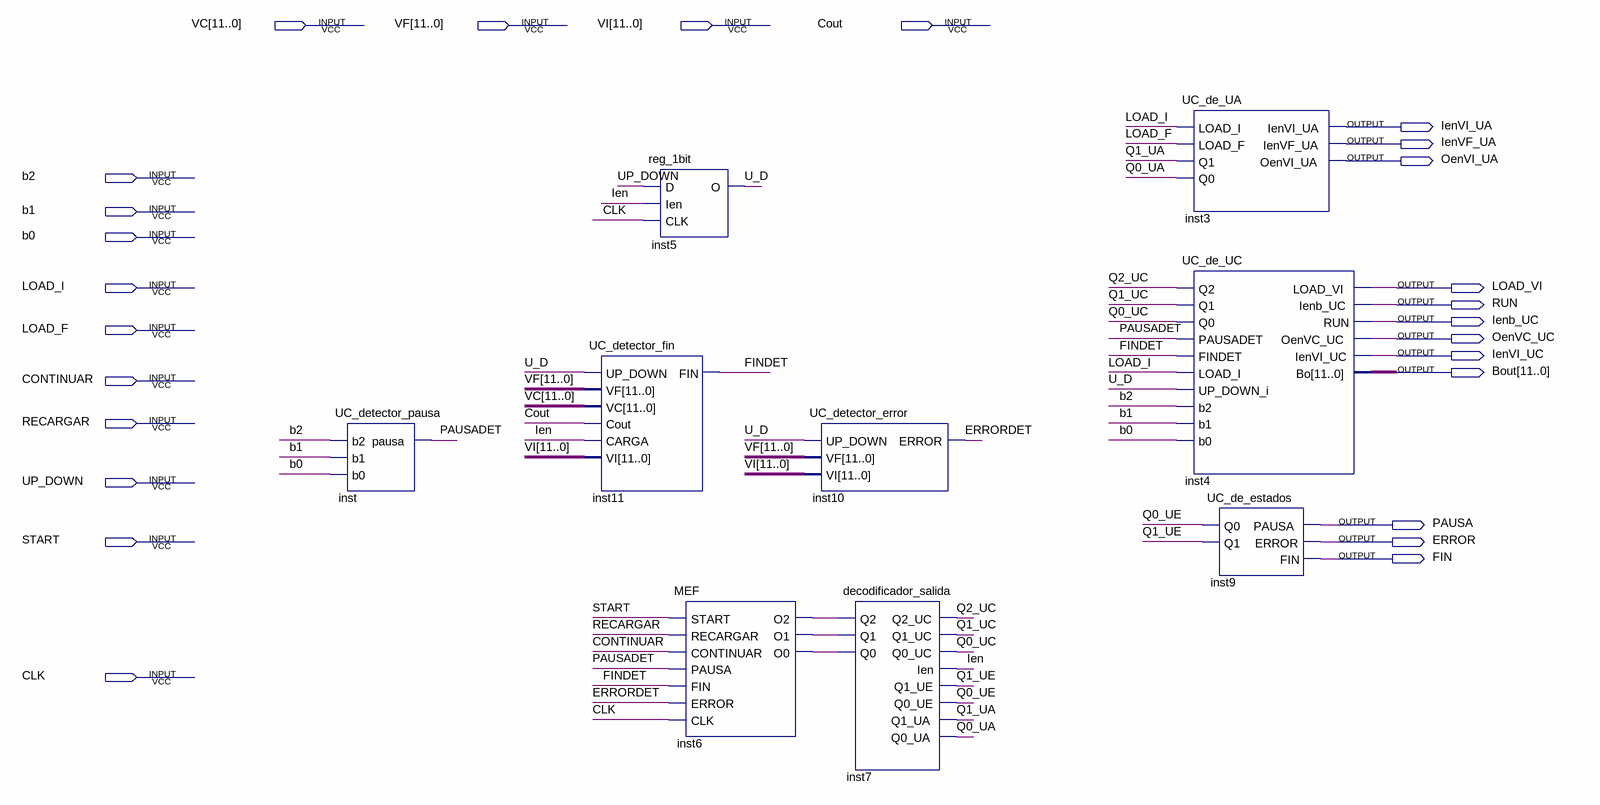
[diagram p0: schematic sheet]
// Quartus schematic unidad_control.bdf as structural Verilog: 9 symbols, 26 pins
module unidad_control (
  input  [11:0] VC,
  input  [11:0] VF,
  input  [11:0] VI,
  input  Cout,
  input  b2,
  input  b1,
  input  b0,
  input  LOAD_I,
  input  LOAD_F,
  input  CONTINUAR,
  input  RECARGAR,
  input  UP_DOWN,
  input  START,
  input  CLK,
  output IenVI_UA,
  output IenVF_UA,
  output OenVI_UA,
  output LOAD_VI,
  output RUN,
  output Ienb_UC,
  output OenVC_UC,
  output IenVI_UC,
  output [11:0] Bout,
  output PAUSA,
  output ERROR,
  output FIN
);

  wire ERRORDET, FINDET, Ien, inst6_o0, inst6_o1, inst6_o2, PAUSADET, Q0_UA, Q0_UC, Q0_UE, Q1_UA, Q1_UC,
       Q1_UE, Q2_UC, U_D;

  UC_detector_pausa inst (.b2(b2), .b1(b1), .b0(b0), .pausa(PAUSADET));
  UC_detector_fin inst11 (.UP_DOWN(U_D), .VF(VF), .VC(VC), .Cout(Cout), .CARGA(Ien), .VI(VI), .FIN(FINDET));
  reg_1bit inst5 (.D(UP_DOWN), .Ien(Ien), .CLK(CLK), .O(U_D));
  MEF inst6 (
    .START(START), .RECARGAR(RECARGAR), .CONTINUAR(CONTINUAR), .PAUSA(PAUSADET), .FIN(FINDET),
    .ERROR(ERRORDET), .CLK(CLK), .O2(inst6_o2), .O1(inst6_o1), .O0(inst6_o0));
  UC_detector_error inst10 (.UP_DOWN(U_D), .VF(VF), .VI(VI), .ERROR(ERRORDET));
  decodificador_salida inst7 (
    .Q2(inst6_o2), .Q1(inst6_o1), .Q0(inst6_o0), .Q2_UC(Q2_UC), .Q1_UC(Q1_UC), .Q0_UC(Q0_UC), .Ien(Ien),
    .Q1_UE(Q1_UE), .Q0_UE(Q0_UE), .Q1_UA(Q1_UA), .Q0_UA(Q0_UA));
  UC_de_UA inst3 (
    .LOAD_I(LOAD_I), .LOAD_F(LOAD_F), .Q1(Q1_UA), .Q0(Q0_UA), .IenVI_UA(IenVI_UA), .IenVF_UA(IenVF_UA),
    .OenVI_UA(OenVI_UA));
  UC_de_UC inst4 (
    .Q2(Q2_UC), .Q1(Q1_UC), .Q0(Q0_UC), .PAUSADET(PAUSADET), .FINDET(FINDET), .LOAD_I(LOAD_I),
    .UP_DOWN_i(U_D), .b2(b2), .b1(b1), .b0(b0), .LOAD_VI(LOAD_VI), .Ienb_UC(RUN), .RUN(Ienb_UC),
    .OenVC_UC(OenVC_UC), .IenVI_UC(IenVI_UC), .Bo(Bout));
  UC_de_estados inst9 (.Q0(Q0_UE), .Q1(Q1_UE), .PAUSA(PAUSA), .ERROR(ERROR), .FIN(FIN));
endmodule
